# EasyEDA Pro project ProPrj_AUCompetition.epro, board 扩展板
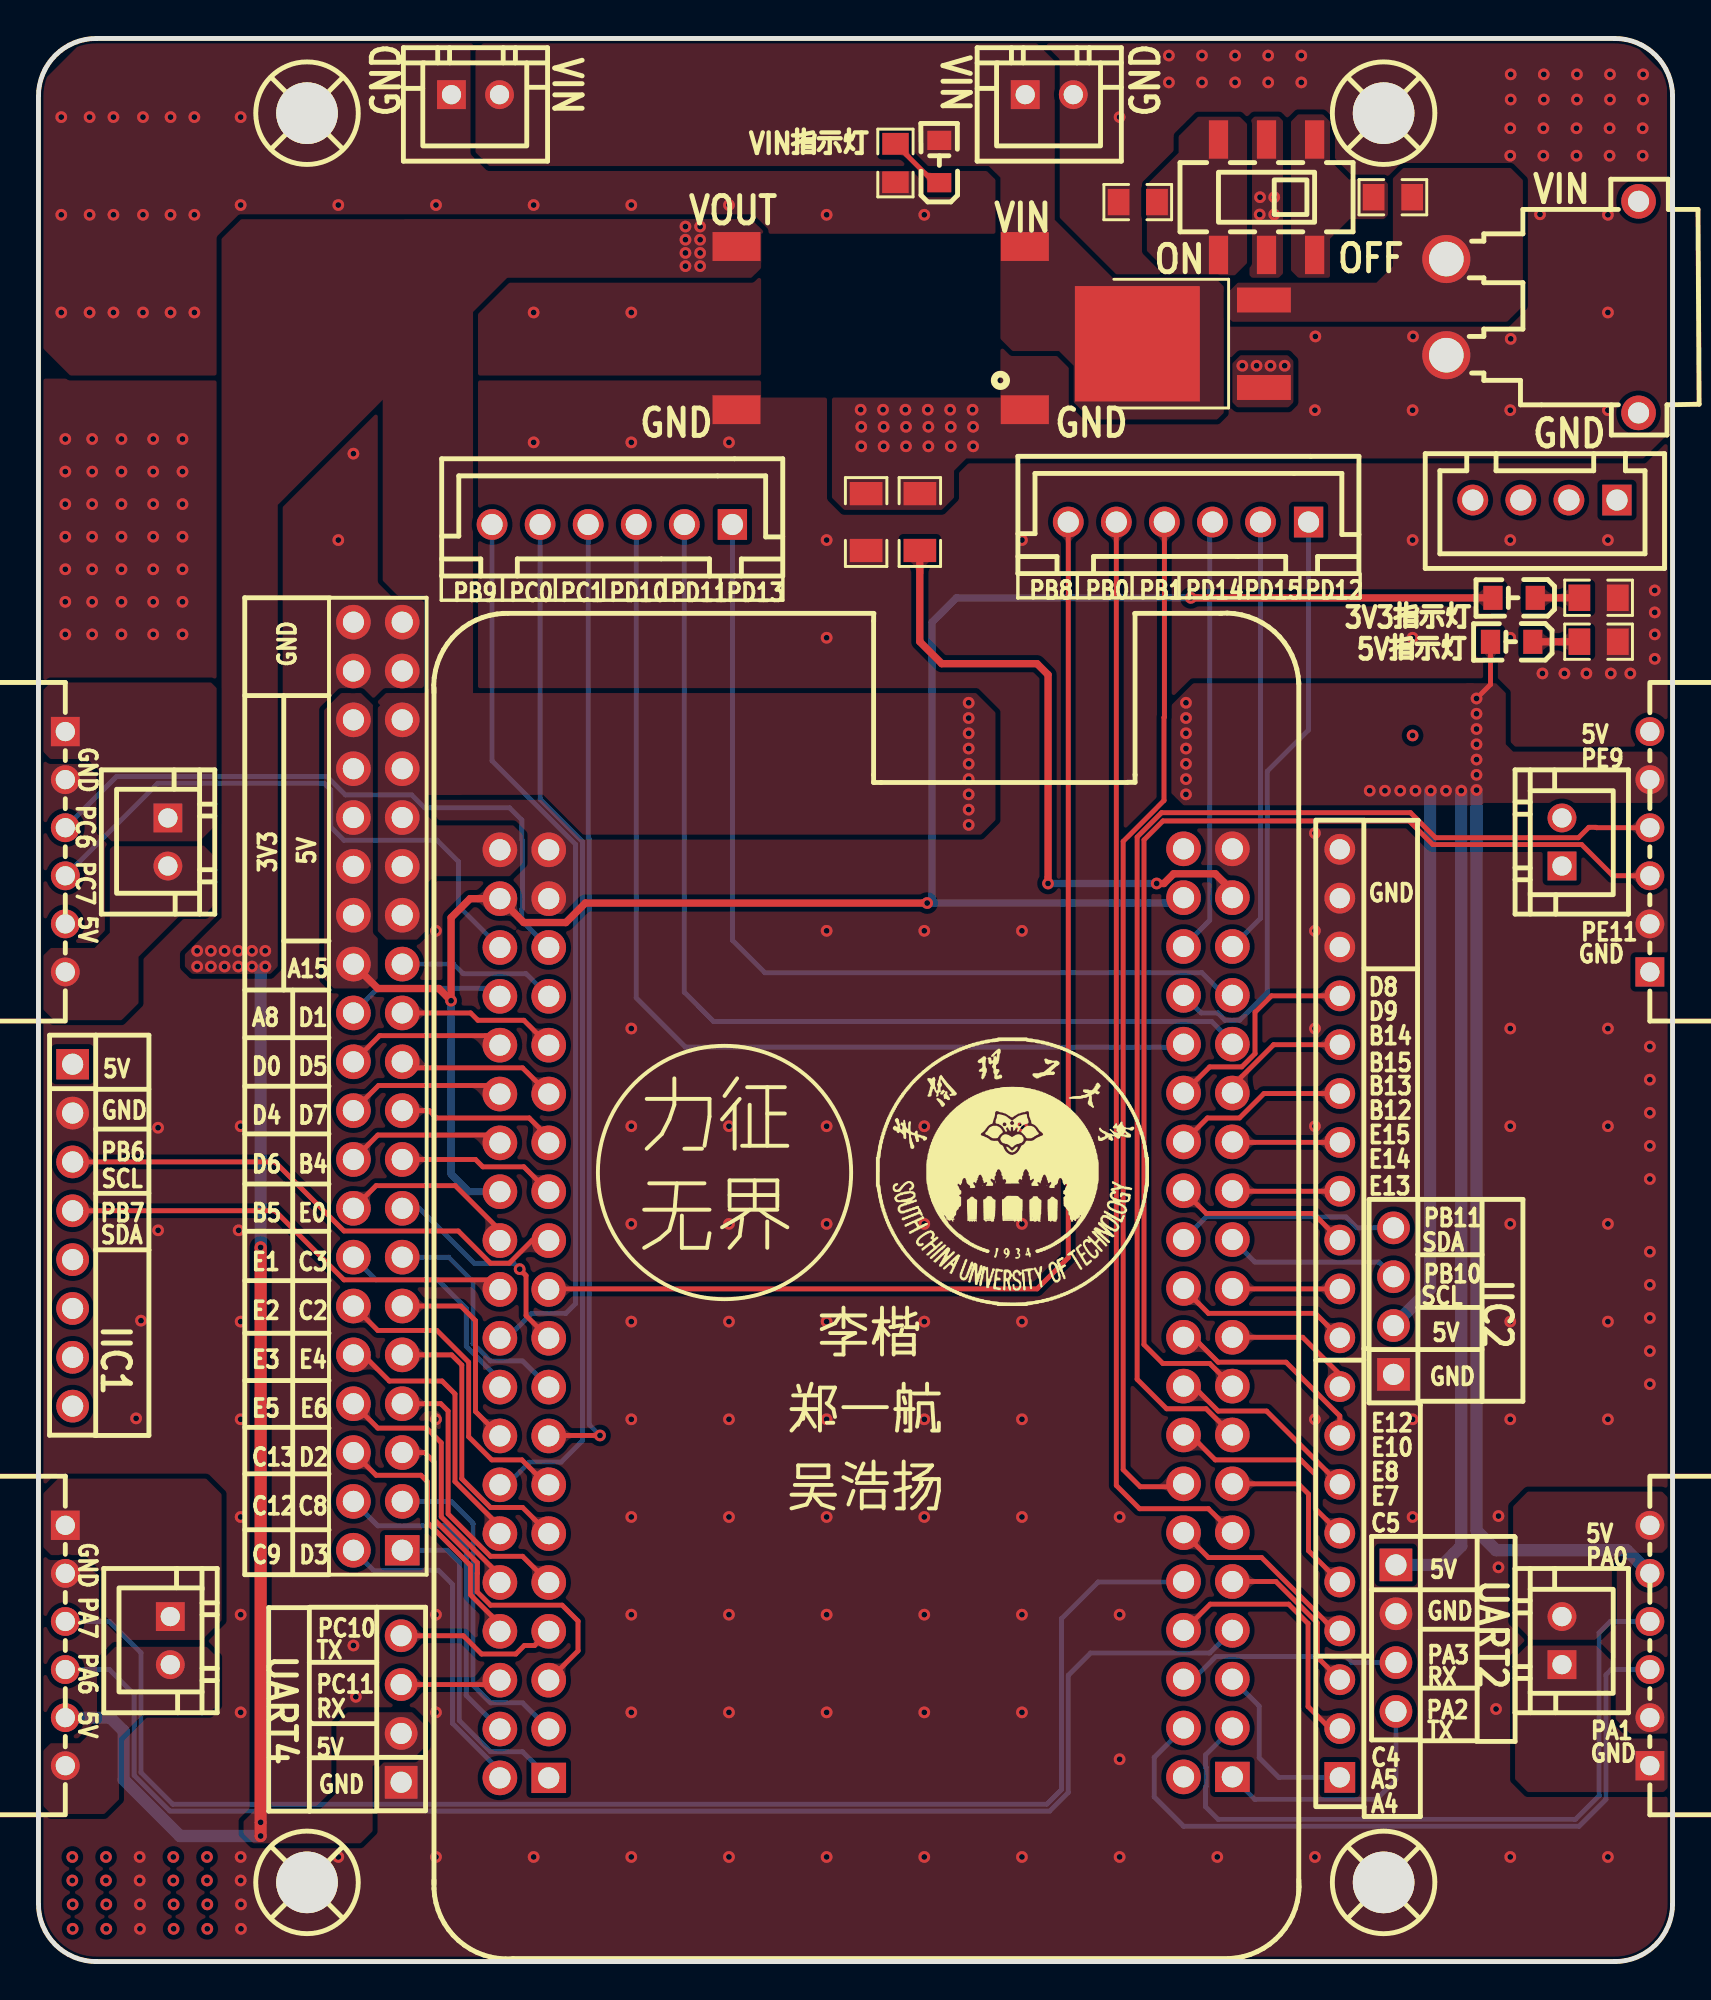
[diagram p5: board, top side]
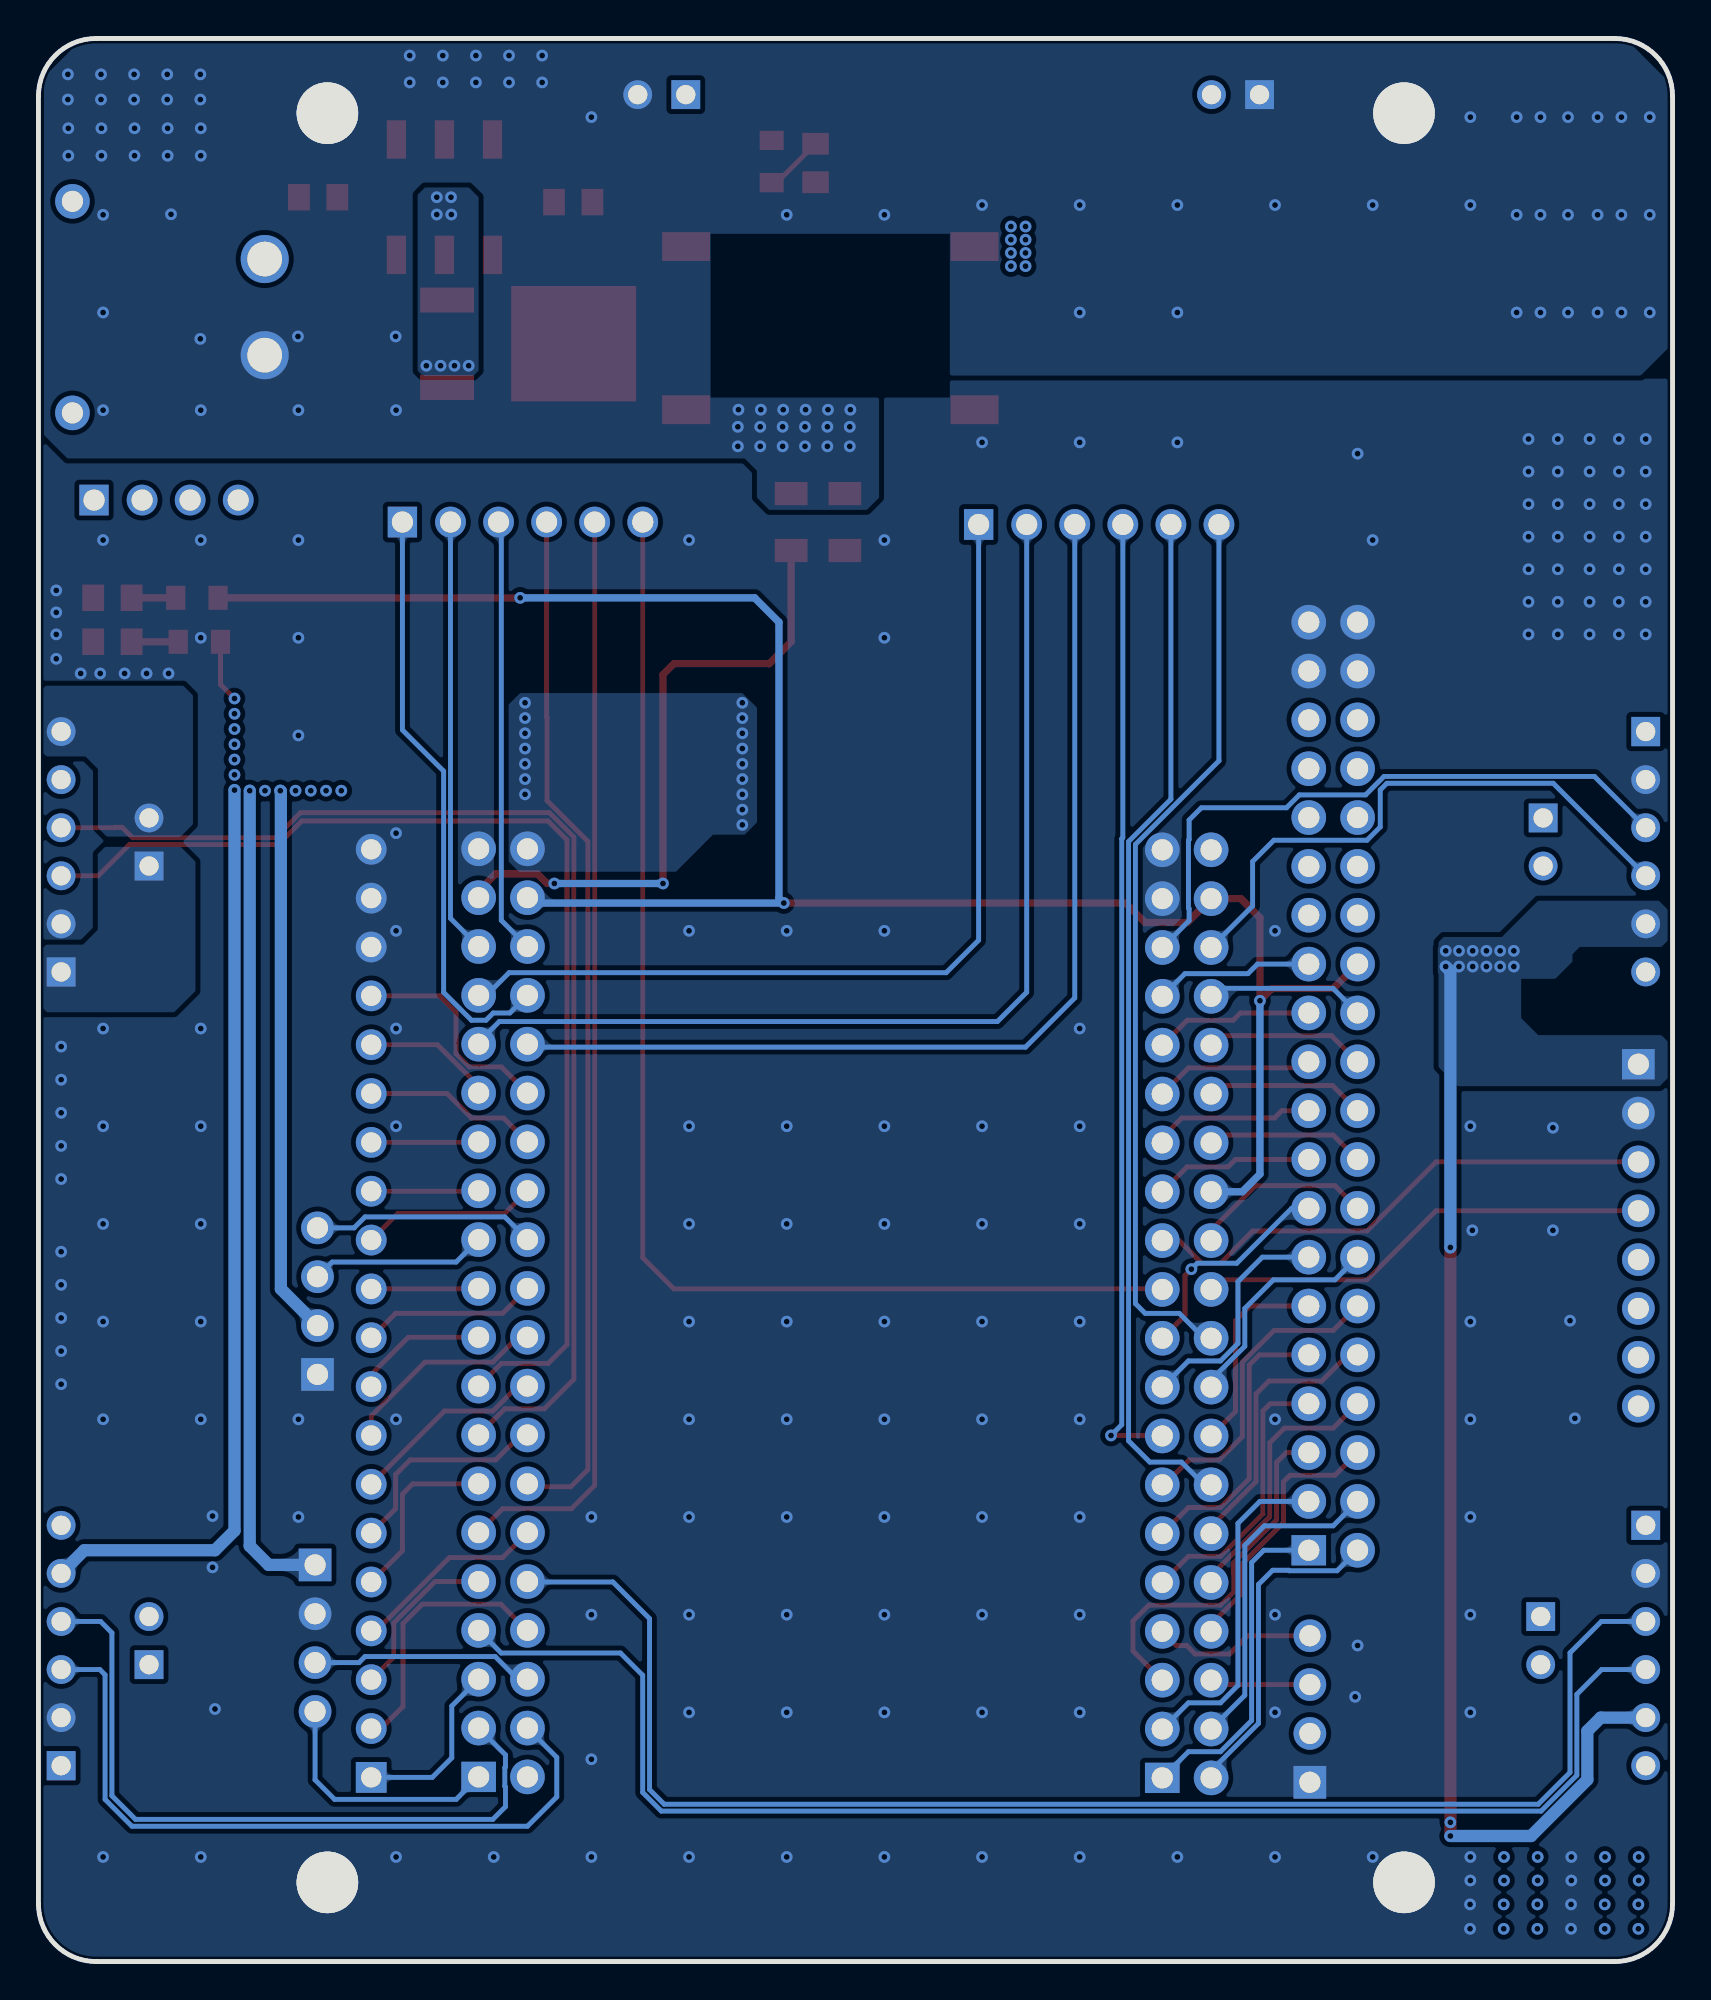
[diagram p6: board, bottom side, seen from below]

Outline 85 x 100 mm; copper layers: Top Layer, Bottom Layer. Coordinates in mm from the lower left corner of the outline.
Outline path: 0,97 0,3 arc(0.88,0.88) 3,0 82,0 arc(84.12,0.88) 85,3 85,97 arc(84.12,99.12) 82,100 3,100 arc(0.88,99.12) 0,97
Stack: Top Layer 0.035mm / Dielectric1 1.51mm FR4 er 4.5 / Bottom Layer 0.035mm

## Design rules (mm)
spacing copperThickness1oz (default): track to track 0.102, other pairs 0.152 to 0.3
spacing copperThickness2oz: track to track 0.203, other pairs 0.152 to 0.3
track width copperThickness1oz (default): min 0.127, default 0.254, max 2.54
track width copperThickness2oz: min 0.203, default 0.254, max 2.54
differential pair differentialPair (default): width min 0.127, default 0.254, max 2.54; gap min 0.152, default 0.152
net RR_OUT2 uses copperRegion
net VIN uses copperRegion
net +5V uses copperRegion
net +3V3 uses copperRegion
net DGND uses copperRegion
net FL_OUT2 uses copperRegion
net FL_OUT1 uses copperRegion
net FR_OUT2 uses copperRegion
net FR_OUT1 uses copperRegion
net RL_OUT2 uses copperRegion
net RL_OUT1 uses copperRegion
net RR_OUT1 uses copperRegion
net $1N204 uses copperRegion
net $1N208 uses copperRegion
net $1N209 uses copperRegion
net $1N206 uses copperRegion

## Placement (name value [footprint] x y rotation side)
CN1  XT30PW-M30.G.Y  [CONN-TH_XT30PW-M]  78.23 86.03 90 top
CN2  HX-XH2.54-2PZZ  [CONN-TH_2P-P2.50_HX-2.54MM-2P-ZZ-MS]  22.73 97.08 0 top
CN3  HX-XH2.54-2PZZ  [CONN-TH_2P-P2.50_HX-2.54MM-2P-ZZ-MS]  52.58 97.08 0 top
CN4  HX-XH2.54-2PZZ  [CONN-TH_2P-P2.50_HX-2.54MM-2P-ZZ-MS]  79.25 16.69 90 top
CN5  HX-XH2.54-2PZZ  [CONN-TH_2P-P2.50_HX-2.54MM-2P-ZZ-MS]  6.86 16.69 270 top
CN6  HX-XH2.54-2PZZ  [CONN-TH_2P-P2.50_HX-2.54MM-2P-ZZ-MS]  79.25 58.22 90 top
CN7  HX-XH2.54-2PZZ  [CONN-TH_2P-P2.50_HX-2.54MM-2P-ZZ-MS]  6.73 58.22 270 top
CN8  ZX-XH2.54-4PZZ  [CONN-TH_4P-P2.50_4PIN]  78.36 76 180 top
H1  2.54-1*4P母  [HDR-TH_4P-P2.54-V-F]  70.48 34.34 90 top
H3  2.54-1*4P母  [HDR-TH_4P-P2.54-V-F]  70.61 16.81 270 top
H4  2.54-1*4P母  [HDR-TH_4P-P2.54-V-F]  18.87 13.13 90 top
LED1  -  [LED_0805]  46.86 93.65 90 top
LED2  -  [LED_0805]  76.58 68.63 180 top
LED3  -  [LED_0805]  76.71 70.92 180 top
Q1  AOD409  [TO-252-2_L6.6-W6.1-P4.57-LS9.9-TL-CW]  60.45 84.13 180 top
R1  10K  [R0805]  70.45 91.75 180 top
R2  10K  [R0805]  57.18 91.49 0 top
R3  0Ω  [R1206]  45.85 74.85 270 top
R4  0Ω  [R1206]  43.05 74.85 270 top
R5  10K  [R0805]  44.58 93.52 270 top
R6  10K  [R0805]  81.15 68.63 0 top
R7  10K  [R0805]  81.15 70.92 0 top
SCREW1  -  [M3螺丝]  13.97 4.12 0 top
SCREW2  -  [M3螺丝]  13.97 96.12 0 top
SCREW3  -  [M3螺丝]  69.97 96.12 0 top
SCREW4  -  [M3螺丝]  69.97 4.12 0 top
U1  LCKFB-LSPI-SkyStar-STM32F407VET6-LITE  [COMM-TH_LCKFB-LSPI-SKYSTAR-STM32F407VET6-LITE]  43.05 33.71 180 top
U2  -  [DCE001]  51.31 80.7 180 top
U3  YSSP2AG00  [SW-SMD_YSSP2AG00]  63.88 91.75 180 top
U4  ZX-XH2.54-6PWZ  [CONN-TH_6P-P2.50_ZX-XH2.54-6PWZ]  83.82 16.43 90 top
U5  ZX-XH2.54-6PWZ  [CONN-TH_6P-P2.50_ZX-XH2.54-6PWZ]  1.4 16.43 270 top
U6  ZX-XH2.54-6PWZ  [CONN-TH_6P-P2.50_ZX-XH2.54-6PWZ]  83.82 57.71 90 top
U7  ZX-XH2.54-6PWZ  [CONN-TH_6P-P2.50_ZX-XH2.54-6PWZ]  1.4 57.71 270 top
U8  ZX-XH2.54-6PZZ  [CONN-TH_6P-P2.50_ZX-XH2.54-6PZZ]  59.82 74.85 0 top
U9  ZX-XH2.54-6PZZ  [CONN-TH_6P-P2.50_ZX-XH2.54-6PZZ]  29.84 74.73 0 top
U10  PZ2.54-2*20  [HDR-TH_40P-P2.54-V-M-R2-C20-S2.54]  17.65 45.52 90 top
U11  PH2.54-01-20PZD  [HDR-TH_20P-P2.54-V-M-4]  67.69 33.71 90 top
U12  PM254-1-08-Z-8.5  [HDR-TH_8P-P2.54-V-F]  1.78 37.77 270 top

## Footprints (pads in the part's own frame, mm; a bottom-side part is the same pattern mirrored in y, then rotated)
COMM-TH_LCKFB-LSPI-SKYSTAR-STM32F407VET6-LITE
  rect 1.8x1.575 hole 1.1: 1(-19.05,24.105) 41(16.51,24.155)
  round 1.8 hole 1.1: 2(-16.51,24.105) 3(-19.05,21.564) 4(-16.51,21.564) 5(-19.05,19.024) 6(-16.51,19.024) 7(-19.05,16.485) 8(-16.51,16.485) 9(-19.05,13.944) 10(-16.51,13.944) 11(-19.05,11.405) 12(-16.51,11.405) 13(-19.05,8.864) 14(-16.51,8.864) 15(-19.05,6.324) 16(-16.51,6.324) 17(-19.05,3.784) 18(-16.51,3.784) 19(-19.05,1.244) 20(-16.51,1.244) 21(-19.05,-1.296) 22(-16.51,-1.296) 23(-19.05,-3.836) 24(-16.51,-3.836) 25(-19.05,-6.375) 26(-16.51,-6.375) 27(-19.05,-8.915) 28(-16.51,-8.915) 29(-19.05,-11.456) 30(-16.51,-11.456) 31(-19.05,-13.995) 32(-16.51,-13.995) 33(-19.05,-16.535) 34(-16.51,-16.535) 35(-19.05,-19.076) 36(-16.51,-19.076) 37(-19.05,-21.616) 38(-16.51,-21.616) 39(-19.05,-24.155) 40(-16.51,-24.155) 42(19.05,24.155) 43(16.51,21.616) 44(19.05,21.616) 45(16.51,19.076) 46(19.05,19.076) 47(16.51,16.535) 48(19.05,16.535) 49(16.51,13.995) 50(19.05,13.995) 51(16.51,11.456) 52(19.05,11.456) 53(16.51,8.915) 54(19.05,8.915) 55(16.51,6.375) 56(19.05,6.375) 57(16.51,3.836) 58(19.05,3.836) 59(16.51,1.296) 60(19.05,1.296) 61(16.51,-1.244) 62(19.05,-1.244) 63(16.51,-3.784) 64(19.05,-3.784) 65(16.51,-6.324) 66(19.05,-6.324) 67(16.51,-8.864) 68(19.05,-8.864) 69(16.51,-11.405) 70(19.05,-11.405) 71(16.51,-13.944) 72(19.05,-13.944) 73(16.51,-16.485) 74(19.05,-16.485) 75(16.51,-19.024) 76(19.05,-19.024) 77(16.51,-21.564) 78(19.05,-21.564) 79(16.51,-24.105) 80(19.05,-24.105)
CONN-TH_2P-P2.50_HX-2.54MM-2P-ZZ-MS
  rect 1.5x1.5 hole 1: 1(-1.25,0)
  round 1.5 hole 1: 2(1.25,0)
CONN-TH_4P-P2.50_4PIN
  rect 1.524x1.6 hole 1.1: 1(-3.75,0)
  round 1.6 hole 1.1: 2(-1.25,0) 3(1.25,0) 4(3.75,0)
CONN-TH_6P-P2.50_ZX-XH2.54-6PWZ
  rect 1.524x1.5 hole 1: 1(-6.25,0)
  round 1.5 hole 1: 2(-3.75,0) 3(-1.25,0) 4(1.25,0) 5(3.75,0) 6(6.25,0)
CONN-TH_6P-P2.50_ZX-XH2.54-6PZZ
  rect 1.524x1.6 hole 1.1: 1(6.25,0)
  round 1.6 hole 1.1: 2(3.75,0) 3(1.25,0) 4(-1.25,0) 5(-3.75,0) 6(-6.25,0)
CONN-TH_XT30PW-M
  round 2.5 hole 1.8: 1(-2.5,5) 2(2.5,5)
  round 1.8 hole 1.1: 3(5.5,-5) 4(-5.5,-5)
DCE001
  rect 2.5x1.5 smd: 1(0,0) 2(0,-8.485) 3(15,0) 4(15,-8.485)
HDR-TH_4P-P2.54-V-F
  rect 1.7x1.7 hole 1.1: 1(-3.81,0)
  round 1.7 hole 1.1: 2(-1.27,0) 3(1.27,0) 4(3.81,0)
HDR-TH_8P-P2.54-V-F
  rect 1.575x1.7 hole 1.1: 1(-8.89,0)
  round 1.7 hole 1.1: 2(-6.35,0) 3(-3.81,0) 4(-1.27,0) 5(1.27,0) 6(3.81,0) 7(6.35,0) 8(8.89,0)
HDR-TH_20P-P2.54-V-M-4
  rect 1.6x1.6 hole 1.05: 1(-24.13,0)
  round 1.6 hole 1.05: 2(-21.59,0) 3(-19.05,0) 4(-16.51,0) 5(-13.97,0) 6(-11.43,0) 7(-8.89,0) 8(-6.35,0) 9(-3.81,0) 10(-1.27,0) 11(1.27,0) 12(3.81,0) 13(6.35,0) 14(8.89,0) 15(11.43,0) 16(13.97,0) 17(16.51,0) 18(19.05,0) 19(21.59,0) 20(24.13,0)
HDR-TH_40P-P2.54-V-M-R2-C20-S2.54
  rect 1.575x1.8 hole 1.1: 1(-24.13,-1.27)
  round 1.8 hole 1.1: 2(-24.13,1.27) 3(-21.59,-1.27) 4(-21.59,1.27) 5(-19.05,-1.27) 6(-19.05,1.27) 7(-16.51,-1.27) 8(-16.51,1.27) 9(-13.97,-1.27) 10(-13.97,1.27) 11(-11.43,-1.27) 12(-11.43,1.27) 13(-8.89,-1.27) 14(-8.89,1.27) 15(-6.35,-1.27) 16(-6.35,1.27) 17(-3.81,-1.27) 18(-3.81,1.27) 19(-1.27,-1.27) 20(-1.27,1.27) 21(1.27,-1.27) 22(1.27,1.27) 23(3.81,-1.27) 24(3.81,1.27) 25(6.35,-1.27) 26(6.35,1.27) 27(8.89,-1.27) 28(8.89,1.27) 29(11.43,-1.27) 30(11.43,1.27) 31(13.97,-1.27) 32(13.97,1.27) 33(16.51,-1.27) 34(16.51,1.27) 35(19.05,-1.27) 36(19.05,1.27) 37(21.59,-1.27) 38(21.59,1.27) 39(24.13,-1.27) 40(24.13,1.27)
LED_0805
  rect 1x1.25 smd: 1(-1.15,0.005) 2(1.05,0.005)
M3螺丝
  round 3.2 hole 3.2: 1(0,0)
R0805
  rect 1.133x1.377 smd: 1(-1,0) 2(1,0)
R1206
  rect 1.208x1.701 smd: 1(-1.479,0) 2(1.479,0)
SW-SMD_YSSP2AG00
  rect 1x2 smd: 1(-2.5,3) 2(0,3) 3(2.5,3) 4(-2.5,-3) 5(0,-3) 6(2.5,-3)
TO-252-2_L6.6-W6.1-P4.57-LS9.9-TL-CW
  rect 2.8x1.3 smd: 1(-3.292,2.273) 3(-3.292,-2.273)
  rect 6.5x6 smd: 2(3.292,0)

## Nets
As in the schematic.

Pads without a net: CN1 3 4; CN8 1 2 3 4; U1 2; U12 5 6 7 8

## Via types
v1: diameter 0.61, hole 0.305, Top Layer to Bottom Layer, 340 vias

## Routing (per net, layer and track width the routed paths; a pad name or vN(x,y) marks a point on that pad's centre or on a via; arc(x,y) is an arc through that point)
+3V3: length 106.1
  Top Layer w0.381: v1(59.94,70.91) 75.66,70.91 ; v1(46.23,55.04) 28.45,55.04 27.43,54.03 25.25,54.03 U1.78 22.45,55.27 21.46,54.28 v1(21.46,49.96) 20.83,50.6 17.65,50.6 16.38,51.87
  Bottom Layer w0.381: U1.38 59.28,55.04 v1(46.23,55.04) 46.48,55.3 46.48,69.65 47.75,70.91 v1(59.94,70.91) ; U1.66 22.38,40.03 21.46,40.95 v1(21.46,49.96)
+5V: length 182.9
  Top Layer w0.254: v1(74.8,65.68) 75.53,66.41 LED2.2
  Top Layer w0.635: v1(11.56,6.53) v1(11.56,37.14)
  Bottom Layer w0.635: U4.5 82.62,21.39 75.82,21.39 74.8,22.4 v1(74.8,60.92) ; v1(11.56,6.53) 7.36,6.53 4.43,9.46 4.43,11.99 3.74,12.68 U5.5 ; v1(72.42,60.88) 72.39,60.85 72.39,34.98 H1.2 ; v1(11.8,51.74) 11.56,51.5 v1(11.56,37.14) ; v1(74.01,60.88) 74.01,21.61 73.03,20.62 H3.1
  vias: v1(8.25,52.56) v1(8.25,51.74) v1(8.97,52.56) v1(8.97,51.74) v1(9.68,52.56) v1(9.68,51.74) v1(10.4,52.56) v1(10.4,51.74) v1(11.11,52.56) v1(11.11,51.74) v1(11.56,7.24) v1(11.8,52.56) v1(33.66,90.22) v1(33.66,89.53) v1(33.66,88.85) v1(33.66,88.16) v1(34.42,90.22) v1(34.42,89.53) v1(34.42,88.85) v1(34.42,88.16) v1(48.39,65.46) v1(48.39,64.66) v1(48.39,63.87) v1(48.39,63.08) v1(48.39,62.28) v1(48.39,61.49) v1(48.39,60.69) v1(48.39,59.9) v1(48.39,59.11) v1(59.69,65.46) v1(59.69,64.66) v1(59.69,63.87) v1(59.69,63.08) v1(59.69,62.28) v1(59.69,61.49) v1(59.69,60.69) v1(69.25,60.88) v1(70.04,60.88) v1(70.83,60.88) v1(71.63,60.88) v1(73.22,60.88) v1(74.8,64.88) v1(74.8,64.09) v1(74.8,63.3) v1(74.8,62.5) v1(74.8,61.71)
AGND: length 33.5
  Top Layer w0.381: R3.2 45.85,68.63 46.99,67.49 51.94,67.49 52.51,66.92 v1(52.51,56.06) ; U1.37 62.1,55.68 61.22,56.56 59.05,56.56 58.54,56.06 v1(58.17,56.06)
  Bottom Layer w0.381: v1(52.51,56.06) v1(58.17,56.06)
DGND:
  vias: v1(1.4,79.17) v1(1.4,77.48) v1(1.4,75.79) v1(1.4,74.09) v1(1.4,72.4) v1(1.4,70.71) v1(1.4,69.01) v1(2.79,79.17) v1(2.79,77.48) v1(2.79,75.79) v1(2.79,74.09) v1(2.79,72.4) v1(2.79,70.71) v1(2.79,69.01) v1(4.32,79.17) v1(4.32,77.48) v1(4.32,75.79) v1(4.32,74.09) v1(4.32,72.4) v1(4.32,70.71) v1(4.32,69.01) v1(5.08,28.25) v1(5.26,5.44) v1(5.26,4.22) v1(5.28,2.97) v1(5.28,1.7) v1(5.33,33.33) v1(5.97,79.17) v1(5.97,77.48) v1(5.97,75.79) v1(5.97,74.09) v1(5.97,72.4) v1(5.97,70.71) v1(5.97,69.01) v1(6.22,43.36) v1(6.22,38.02) v1(7.49,79.17) v1(7.49,77.48) v1(7.49,75.79) v1(7.49,74.09) v1(7.49,72.4) v1(7.49,70.71) v1(7.49,69.01) v1(10.41,38.02) v1(10.52,43.44) v1(10.52,33.28) v1(10.52,28.2) v1(10.52,23.12) v1(10.52,18.04) v1(10.52,12.96) v1(10.52,5.44) v1(10.52,4.22) v1(10.53,2.97) v1(10.53,1.7) v1(15.6,73.92) v1(15.6,5.44) v1(16.38,78.41) v1(16.38,16.43) v1(16.51,13.77) v1(20.68,53.6) v1(20.68,28.2) v1(20.68,18.04) v1(20.68,12.96) v1(20.68,5.44) v1(25.76,79) v1(25.76,5.44) v1(30.84,79) v1(30.84,48.52) v1(30.84,43.44) v1(30.84,38.36) v1(30.84,33.28) v1(30.84,28.2) v1(30.84,23.12) v1(30.84,18.04) v1(30.84,12.96) v1(30.84,5.44) v1(35.92,79) v1(35.92,43.44) v1(35.92,38.36) v1(35.92,33.28) v1(35.92,28.2) v1(35.92,23.12) v1(35.92,18.04) v1(35.92,12.96) v1(35.92,5.44) v1(41,73.92) v1(41,68.84) v1(41,53.6) v1(41,43.44) v1(41,38.36) v1(41,33.28) v1(41,28.2) v1(41,23.12) v1(41,18.04) v1(41,12.96) v1(41,5.44) v1(46.08,53.6) v1(46.08,43.44) v1(46.08,38.36) v1(46.08,33.28) v1(46.08,28.2) v1(46.08,23.12) v1(46.08,18.04) v1(46.08,12.96) v1(46.08,5.44) v1(51.16,73.92) v1(51.16,53.6) v1(51.16,43.44) v1(51.16,38.36) v1(51.16,33.28) v1(51.16,28.2) v1(51.16,23.12) v1(51.16,18.04) v1(51.16,12.96) v1(51.16,5.44) v1(56.24,23.12) v1(56.24,18.04) v1(56.24,10.52) v1(56.24,5.44) v1(61.32,5.44) v1(66.4,58.68) v1(66.4,53.6) v1(66.4,48.52) v1(66.4,43.44) v1(66.4,28.2) v1(66.4,5.44) v1(71.48,73.92) v1(71.48,68.84) v1(71.48,63.76) v1(71.48,28.2) v1(71.48,23.12) v1(75.82,13.13) v1(75.95,23.17) v1(75.95,20.5) v1(76.56,73.92) v1(76.56,68.84) v1(76.56,48.52) v1(76.56,43.44) v1(76.56,38.36) v1(76.56,33.28) v1(76.56,28.2) v1(76.56,5.44) v1(78.23,66.98) v1(79.38,66.98) v1(80.52,66.98) v1(81.64,73.92) v1(81.64,48.52) v1(81.64,43.44) v1(81.64,38.36) v1(81.64,33.28) v1(81.64,28.2) v1(81.64,5.44) v1(81.79,66.98) v1(82.8,66.98) v1(83.82,47.58) v1(83.82,45.86) v1(83.82,44.14) v1(83.82,42.41) v1(83.82,40.69) v1(83.82,36.91) v1(83.82,35.19) v1(83.82,33.47) v1(83.82,31.75) v1(83.82,30.02) v1(84.07,71.3) v1(84.07,70.16) v1(84.07,69.01) v1(84.07,67.74)
PGND:
  vias: v1(1.19,95.91) v1(1.19,90.83) v1(1.19,85.75) v1(2.66,95.91) v1(2.66,90.83) v1(2.66,85.75) v1(3.9,95.91) v1(3.9,90.83) v1(3.9,85.75) v1(5.44,95.91) v1(5.44,90.83) v1(5.44,85.75) v1(6.87,95.91) v1(6.87,90.83) v1(6.87,85.75) v1(8.11,95.91) v1(8.11,90.83) v1(8.11,85.75) v1(10.52,95.91) v1(10.52,91.34) v1(15.6,91.34) v1(20.68,91.34) v1(25.76,91.34) v1(25.76,85.75) v1(30.84,91.34) v1(30.84,85.75) v1(35.92,91.34) v1(41,90.83) v1(42.77,80.7) v1(42.8,79.81) v1(42.8,78.79) v1(43.93,80.7) v1(43.96,79.81) v1(43.96,78.79) v1(45.1,80.7) v1(45.13,79.81) v1(45.13,78.79) v1(46.08,90.83) v1(46.26,80.7) v1(46.29,79.81) v1(46.29,78.79) v1(47.42,80.7) v1(47.46,79.81) v1(47.46,78.79) v1(48.59,80.7) v1(48.62,79.81) v1(48.62,78.79) v1(56.24,95.91) v1(58.8,99.11) v1(58.8,97.71) v1(60.52,99.11) v1(60.52,97.71) v1(62.25,99.11) v1(62.25,97.71) v1(63.97,99.11) v1(63.97,97.71) v1(65.69,99.11) v1(65.69,97.71) v1(66.4,80.67) v1(66.42,84.51) v1(71.5,84.51) v1(71.48,80.67) v1(76.58,98.13) v1(76.58,96.83) v1(76.56,95.33) v1(76.56,93.9) v1(76.58,84.38) v1(76.56,80.67) v1(78.1,90.86) v1(78.3,98.13) v1(78.3,96.83) v1(78.28,95.33) v1(78.28,93.9) v1(80,95.33) v1(80,93.9) v1(80.03,98.13) v1(80.03,96.83) v1(81.64,90.83) v1(81.64,85.75) v1(81.64,80.67) v1(81.75,98.13) v1(81.75,96.83) v1(81.72,95.33) v1(81.72,93.9) v1(83.47,98.13) v1(83.47,96.83) v1(83.45,95.33) v1(83.45,93.9)
(no net):
  vias: v1(1.76,5.44) v1(1.76,4.22) v1(1.78,2.97) v1(1.78,1.7) v1(3.51,5.44) v1(3.51,4.22) v1(3.53,2.97) v1(3.53,1.7) v1(7.02,5.44) v1(7.02,4.22) v1(7.03,2.97) v1(7.03,1.7) v1(8.77,5.44) v1(8.77,4.22) v1(8.78,2.97) v1(8.78,1.7)
FL_EN: length 66
  Top Layer w0.254: U1.61 26.57,34.98 51.94,34.98 53.57,36.6 U8.6
FL_ENCA: length 37.3
  Bottom Layer w0.254: U4.4 81.77,17.68 81.18,17.09 81.18,8.62 79.95,7.39 61.37,7.39 60.71,8.05 60.71,9.08 60.74,9.11 60.74,10.09 60.71,10.13 60.71,10.74 U1.3
FL_ENCB: length 37.8
  Bottom Layer w0.254: U4.3 81.81,15.18 81.53,14.91 81.53,8.43 80.14,7.04 59.56,7.04 58.04,8.56 58.04,10.62 U1.4
FL_IN1: length 57.2
  Top Layer w0.254: U8.5 56.07,24.76 57.28,23.55 60.86,23.55 U1.11
FL_IN2: length 53.7
  Top Layer w0.254: U8.4 58.57,64.71 58.55,64.69 58.55,60.37 56.42,58.25 56.42,25.58 57.31,24.69 59.41,24.69 U1.14
FR_1N2: length 50.3
  Top Layer w0.254: v1(29.21,27.36) 26.57,27.36 U1.55
  Bottom Layer w0.254: v1(29.21,27.36) 28.65,27.91 28.65,58.39 28.59,58.44 U9.4
FR_EN: length 47
  Bottom Layer w0.254: U1.60 24.36,32.41 25.66,33.71 27.43,33.71 27.94,34.21 27.94,58.09 23.59,62.44 U9.6
FR_ENCA: length 73.7
  Bottom Layer w0.254: U5.4 3.69,15.18 4.98,13.89 4.98,9.68 6.84,7.82 52.6,7.82 53.57,8.79 53.57,14.89 54.73,16.04 60.92,16.04 U1.7
FR_ENCB: length 75.8
  Bottom Layer w0.254: U1.10 59.54,19.74 55.12,19.74 53.21,17.83 53.21,8.94 52.45,8.18 6.98,8.18 5.33,9.83 5.33,16.05 3.7,17.68 U5.3
FR_IN1: length 53.8
  Bottom Layer w0.254: U1.54 24.36,24.79 25.54,25.97 27.19,25.97 28.3,27.08 28.3,58.24 26.09,60.44 U9.5
IIC1_SCL: length 27.4
  Top Layer w0.254: U12.3 12.3,41.58 15.89,37.99 21.84,37.99 23.51,36.31 24.49,36.31 25.67,37.49 U1.63
IIC1_SDA: length 23.9
  Top Layer w0.254: U12.4 12.3,39.04 15.89,35.45 23.51,35.45 U1.62
IIC2_SCL: length 9.2
  Bottom Layer w0.254: U1.23 63.27,36.37 69.72,36.37 H1.3
IIC2_SDA: length 11.6
  Bottom Layer w0.254: H1.4 68.58,38.15 68.01,38.72 60.74,38.72 U1.24
PA2: length 13
  Bottom Layer w0.254: H3.4 70.61,9.45 69.6,8.43 63.27,8.43 U1.1
PA3: length 11.7
  Bottom Layer w0.254: H3.3 68.33,15.55 68.01,15.86 61.25,15.86 60.07,14.68 U1.6
PA4: length 9.3
  Bottom Layer w0.254: U1.5 63.5,13.28 63.5,10.59 64.52,9.58 U11.1
PA5: length 13.9
  Top Layer w0.254: U1.8 59.59,17.22 60.95,18.58 65.03,18.58 66.04,17.58 66.04,13.26 67.18,12.12 U11.2
PA8: length 8.3
  Bottom Layer w0.254: 16.38,49.33 17.66,50.61 23.59,50.61 U1.74
PA15: length 8.3
  Bottom Layer w0.254: U1.73 25.36,51.37 22.09,51.37 21.59,51.87 U10.25
PB4: length 8.3
  Top Layer w0.254: U10.17 22.73,41.71 23.11,41.33 25.25,41.33 U1.65
PB5: length 9.6
  Top Layer w0.254: 16.38,39.17 17.56,40.35 21.68,40.35 24,38.02 U1.64
PB12: length 9.2
  Top Layer w0.254: U1.26 60.74,38.9 66.3,38.9 U11.12
PB13: length 5.6
  Top Layer w0.254: U11.13 62.13,40.06 U1.25
PB14: length 9.2
  Top Layer w0.254: U11.15 63.75,45.14 62.47,43.87 60.81,43.87 U1.28
PB15: length 5.6
  Top Layer w0.254: U11.14 62.13,42.6 U1.27
PC2: length 10.6
  Top Layer w0.254: U1.56 22.73,28.6 22.73,33.33 21.97,34.09 U10.11
PC3: length 12.3
  Bottom Layer w0.254: U10.13 21.34,36.63 22.61,35.36 22.61,32.14 23.51,31.23 25.18,31.23 U1.57
PC4: length 8.7
  Top Layer w0.254: U1.9 64.37,19.76 66.52,17.61 66.52,15.83 U11.3
PC5: length 10.2
  Top Layer w0.254: U11.4 67.44,17.2 63.63,21.01 60.86,21.01 U1.12
PC6: length 33
  Bottom Layer w0.254: U7.3 4.06,61.63 15.01,61.63 15.97,60.67 19.41,60.67 20.08,60 24.51,60 25.15,59.36 25.15,58.34 25.18,58.3 25.18,54.78 25.15,54.75 25.15,54.13 U1.75
PC7: length 30.6
  Bottom Layer w0.254: U1.76 21.84,54.89 21.84,57.2 20.74,58.31 15.89,58.31 15.2,59 15.2,60.92 14.86,61.27 6.21,61.27 U7.4
PC8: length 17.5
  Bottom Layer w0.254: U1.43 25.18,13.45 23.51,13.45 22.61,14.36 22.61,22.78 21.46,23.93 U10.3
PC9: length 17
  Bottom Layer w0.254: 16.38,21.39 17.45,20.32 19.94,20.32 19.96,20.35 20.8,20.35 21.54,19.61 21.54,12.39 24,9.92 U1.42
PC10: length 8.6
  Top Layer w0.254: U1.47 25.81,16.43 25.27,16.43 24.83,15.99 23.05,15.99 22.1,16.94 H4.4
PC11: length 5.2
  Top Layer w0.254: U1.46 23.77,14.4 H4.3
PC12: length 17.1
  Bottom Layer w0.254: 16.38,23.93 17.65,22.66 21.23,22.66 22.25,21.64 22.25,13.84 U1.44
PC13: length 13.8
  Top Layer w0.254: 16.38,26.47 17.56,25.29 19.9,25.29 20.24,24.94 20.24,22.82 22.47,20.6 22.47,19.08 24,17.54 U1.48
PD0: length 8.4
  Top Layer w0.254: U1.72 23.51,48.15 17.74,48.15 16.38,46.79
PD1: length 8.3
  Top Layer w0.254: U10.23 22.48,49.33 22.86,48.95 25.25,48.95 U1.71
PD2: length 19.1
  Top Layer w0.254: U1.45 28.07,16.15 28.07,17.7 27.24,18.53 23.51,18.53 22.82,19.22 22.82,20.2 22.83,20.21 22.83,20.74 20.6,22.97 20.6,25.96 20.09,26.47 U10.5
PD3: length 17.3
  Bottom Layer w0.254: U1.41 25.18,10.91 23.51,10.91 21.89,12.53 21.89,20.75 21.26,21.39 U10.1
PD4: length 8.3
  Top Layer w0.254: 16.38,44.25 17.69,45.55 23.56,45.55 U1.70
PD5: length 8.3
  Top Layer w0.254: U1.69 25.18,46.47 19.24,46.47 U10.21
PD6: length 8.3
  Top Layer w0.254: 16.38,41.71 17.65,42.98 23.6,42.98 U1.68
PD7: length 8.5
  Top Layer w0.254: U1.67 26.54,42.85 25.53,43.87 20.7,43.87 20.32,44.25 U10.19
PD8: length 11.5
  Top Layer w0.254: U11.17 64.13,50.22 63.28,49.36 63.28,47.21 62.59,46.52 60.92,46.52 U1.30
PD9: length 6.8
  Top Layer w0.254: U11.16 64.25,47.68 62.1,45.53 U1.29
PD10: length 54.2
  Bottom Layer w0.254: U1.32 59.41,47.55 33.66,47.55 31.1,50.11 U9.3
PD11: length 54
  Bottom Layer w0.254: U1.31 62.1,47.8 61.03,48.88 35.12,48.88 33.59,50.4 U9.2
PD12: length 30.8
  Bottom Layer w0.254: U8.1 66.07,64.04 63.92,61.9 63.92,50.39 62.48,48.95 61.72,48.95 61.34,49.33 60.48,49.33 U1.34
PD13: length 48.8
  Bottom Layer w0.254: U9.1 36.1,53.11 37.78,51.42 60.52,51.42 61.7,50.24 U1.33
PD14: length 22.7
  Bottom Layer w0.254: U8.3 60.92,74.71 60.92,54.14 U1.36
PD15: length 22.7
  Bottom Layer w0.254: U1.35 63.57,54.25 U8.2
PE0: length 11.6
  Top Layer w0.254: v1(25.03,36) 25.36,35.67 25.36,33.59 U1.59
  Bottom Layer w0.254: v1(25.03,36) 24.72,36.31 22.67,36.31 19.81,39.17 U10.15
PE1: length 11.8
  Bottom Layer w0.254: U1.58 24,30.24 22.25,31.99 22.25,33.96 20.76,35.45 17.56,35.45 16.38,36.63
PE2: length 16.3
  Top Layer w0.254: U1.53 26.44,24.79 25.15,26.09 23.58,26.09 22.38,27.29 22.38,31.17 20.73,32.82 17.65,32.82 16.38,34.09
PE3: length 14.4
  Top Layer w0.254: U1.52 24,22.62 21.66,24.96 21.66,29.52 20.99,30.19 18.25,30.19 16.89,31.55 16.38,31.55
PE4: length 14.9
  Top Layer w0.254: U10.9 21.49,31.55 22.02,31.02 22.02,25.11 23.51,23.61 25.18,23.61 U1.51
PE5: length 13.9
  Top Layer w0.254: 16.38,29.01 17.65,27.74 20.19,27.74 20.95,26.98 20.95,23.13 24,20.08 U1.50
PE6: length 14.6
  Top Layer w0.254: U10.7 20.93,29.01 21.31,28.63 21.31,23.28 23.51,21.07 25.18,21.07 U1.49
PE7: length 9.4
  Top Layer w0.254: U1.13 65.53,24.84 66.06,24.31 66.06,21.36 U11.5
PE8: length 11.3
  Top Layer w0.254: U11.6 66.42,23.55 66.42,25.32 65.66,26.09 61.21,26.09 59.92,27.38 U1.16
PE9: length 62.3
  Top Layer w0.254: U1.15 60.74,28.74 58.68,28.74 57.15,30.28 57.15,58.47 58.42,59.74 71.37,59.74 72.67,58.44 80.1,58.44 80.65,58.98 81.03,58.98 81.05,58.96 U6.4
PE10: length 10.2
  Top Layer w0.254: U1.18 60.07,29.92 61.36,28.63 63.88,28.63 U11.7
PE11: length 59.6
  Top Layer w0.254: U6.3 81.9,56.46 80.27,58.08 72.53,58.08 71.3,59.31 58.49,59.31 57.51,58.32 57.51,32.08 58.49,31.1 60.92,31.1 U1.17
PE12: length 10.8
  Top Layer w0.254: U1.20 59.84,32.18 60.35,32.18 61.36,31.17 64.9,31.17 67.69,28.37 U11.8
PE13: length 7
  Top Layer w0.254: U11.9 67.69,30.53 65.76,32.46 U1.19
PE14: length 9.2
  Top Layer w0.254: U11.10 66.42,33.71 60.86,33.71 U1.22
PE15: length 5.6
  Top Layer w0.254: U1.21 62.13,34.98 U11.11
$1N208:
  vias: v1(62.62,82.98) v1(63.36,82.98) v1(63.54,91.75) v1(63.52,90.84) v1(64.09,82.98) v1(64.28,91.75) v1(64.28,90.84) v1(64.82,82.98)
$1N243: length 3.1
  Top Layer w0.254: R5.1 46.6,92.5 LED1.1
$1N244: length 2.4
  Top Layer w0.381: LED2.1 80.15,68.63 R6.1
$1N245: length 2.3
  Top Layer w0.381: 77.86,70.91 80.15,70.91 R7.1

## Copper pours and planes (outline as drawn; the poured copper is in the pictures)
+3V3 on Top Layer: 17.65,65.09 17.65,51.13 17.12,50.6 15.37,50.6 14.86,51.11 14.86,65.08 15.75,65.96 16.78,65.96
+5V on Top Layer: 8,51.36 7.62,51.74 7.62,52.38 9.53,54.28 9.53,89.59 10.54,90.6 36.83,90.6 37.59,89.84 37.59,88.32 36.96,87.68 24.38,87.68 12.45,75.74 12.45,51.74 12.06,51.36
+5V on Top Layer: 18.41,65.96 19.63,65.96 20.19,65.4 20.19,59.63 20.74,59.08 24.7,59.08 25.18,58.6 25.18,57.11 24.51,56.44 20.59,56.44 20.19,56.04 20.19,53.65 19.69,53.14 18.09,53.14 17.65,53.58 17.65,65.2
+5V on Top Layer: 37.72,89.97 37.72,88.19 37.08,87.55 24.38,87.55 22.61,85.78 22.61,61.27 22.01,60.67 18.31,60.67 17.65,61.32 17.65,65.31 18.18,65.84 19.94,65.84 20.32,66.22 20.32,70.79 20.07,71.04 18.67,71.04 17.91,71.81 17.91,89.46 19.05,90.6 37.08,90.6
+5V on Top Layer: 60.07,66.47 74.68,66.47 75.44,65.71 75.44,60.5 75.06,60.12 59.56,60.12 58.93,60.76 58.93,65.33
+5V on Top Layer: 85,62.36 85,60.88 84.37,60.25 74.42,60.25 74.04,60.63 74.04,66.22 74.29,66.47 75.82,66.47 76.33,65.96 76.33,63.3 76.71,62.92 84.44,62.92
+5V on Top Layer: 18.08,65.96 48.77,65.96 49.78,64.95 49.78,59.36 49.02,58.6 28.32,58.6 26.25,60.67 18.38,60.67 17.65,61.39 17.65,65.54
+5V on Top Layer: 20.14,12.26 20.14,11.19 19.56,10.62 17.85,10.62 17.38,10.15 17.38,6.78 16.75,6.15 11.18,6.15 10.67,6.66 10.67,7.29 11.2,7.82 14.56,7.82 15.49,8.75 15.49,12.37 16.09,12.97 19.43,12.97
+5V on Bottom Layer: 0,54.46 0.71,55.17 6.98,55.17 9.14,53.01 11.94,53.01 12.21,52.74 12.21,51.41 12,51.11 6.1,51.11 5.21,51.99 5.21,52.38 4.83,52.76 0.58,52.76 0,53.33
+5V on Bottom Layer: 0,47.59 0.58,48.17 6.98,48.17 7.87,49.06 7.87,52.9 8.25,53.28 11.91,53.28 12.17,53.01 12.17,46.51 11.18,45.52 0.67,45.52 0,46.18
+5V on Bottom Layer: 47.62,65.2 48.39,65.96 59.94,65.96 60.58,65.33 60.58,57.24 60.01,56.67 51.84,56.67 49.91,58.6 48.26,58.6 47.62,59.23
DGND on Top Layer: 0,82.31 84.96,82.31 84.96,-0.08 0,-0.08
DGND on Bottom Layer: 0,82.31 84.96,82.31 84.96,-0.08 0,-0.08
PGND on Top Layer: 41.28,76.12 41.28,81.46 40.26,82.47 1.65,82.47 0.06,84.06 0.06,97.62 2.33,99.89 82.82,99.89 84.71,97.99 84.71,79.38 83.49,78.16 48.26,78.16 47.62,77.52 47.62,76.12 46.99,75.49 41.91,75.49
PGND on Bottom Layer: 41.28,76.12 41.28,81.46 40.26,82.47 1.65,82.47 0.06,84.06 0.06,97.62 2.33,99.89 82.82,99.89 84.71,97.99 84.71,79.38 83.49,78.16 48.26,78.16 47.62,77.52 47.62,76.12 46.99,75.49 41.91,75.49
VIN on Top Layer: 55.96,87.48 61.28,87.48 61.65,87.11 61.65,80.53 61.31,80.19 54.74,80.19 53.85,81.08 53.85,82.98 53.09,83.74 50.67,83.74 50.04,84.38 50.04,92.76 49.43,93.37 23.45,93.37 22.73,94.08 22.73,99.37 23.37,100 51.68,100 52.87,98.82 52.87,90.57
FL_OUT1 on Top Layer: 84.46,24.44 85,23.89 85,21.78 84.48,21.26 82.42,21.26 81.84,20.68 81.84,17.6 80.97,16.73 77.66,16.73 76.71,17.69 76.71,23.67 77.47,24.44
FL_OUT2 on Top Layer: 85,11.21 85,9.28 84.53,8.81 77.47,8.81 76.81,9.48 76.81,15.82 77.43,16.43 81.03,16.43 81.79,15.67 81.79,12.5 82.69,11.6 84.61,11.6
FR_OUT1 on Top Layer: 0,10.72 0.64,11.35 2.16,11.35 3.3,12.5 3.3,15.67 3.99,16.36 8.75,16.36 9.3,15.82 9.3,13.33 8.9,12.94 5.52,12.94 4.19,11.61 4.19,8.43 3.43,7.67 0.66,7.67 0,8.33
FR_OUT2 on Top Layer: 0,24.09 1.02,25.11 8.72,25.11 9.53,24.31 9.53,17.74 8.51,16.72 4.73,16.72 3.4,18.06 3.4,20.15 2.41,21.13 0.66,21.13 0,21.79
RL_OUT1 on Bottom Layer: 85,65.96 85,63.08 84.58,62.66 82.55,62.66 81.91,62.02 81.91,58.96 81.45,58.5 77.6,58.5 76.96,59.13 76.96,65.84 77.47,66.35 84.61,66.35
RL_OUT2 on Bottom Layer: 85,49.8 84.56,49.36 77.94,49.36 76.84,50.47 76.84,57.2 77.6,57.96 81.53,57.96 81.91,57.58 81.91,53.65 82.68,52.88 84.6,52.88 85,52.48
RR_OUT1 on Top Layer: 0,52.07 0.64,52.71 2.92,52.71 3.71,53.5 3.71,57.85 4.08,58.22 8.41,58.22 9.14,57.49 9.14,54.94 8.67,54.47 7.43,54.47 5.21,52.25 5.21,49.84 4.32,48.95 0.8,48.95 0,49.75
RR_OUT2 on Top Layer: 0,65.88 0.64,66.51 8.98,66.51 9.27,66.22 9.27,59.14 8.38,58.25 3.8,58.25 3.27,58.78 3.27,61.8 2.54,62.54 0.62,62.54 0,63.15
$1N204 on Top Layer: 77.22,92.63 77.22,86.09 76.39,85.27 62.1,85.27 61.91,85.46 61.91,86.82 62.39,87.3 69.6,87.3 70.45,88.16 70.45,92.73 70.99,93.27 76.58,93.27
$1N206 on Top Layer: 69.98,92.66 70.23,92.41 70.23,90.86 69.98,90.6 68.2,90.6 67.18,89.59 67.18,87.55 67.06,87.43 65.66,87.43 65.15,87.94 65.15,95.68 65.52,96.05 66.81,96.05 67.18,95.68 67.18,93.65 68.17,92.66
$1N208 on Top Layer: 62.1,83.11 62.52,83.52 64.99,83.52 65.28,83.24 65.28,81.08 65.02,80.82 62.36,80.82 62.1,81.08
$1N208 on Top Layer: 63.25,95.94 64.52,95.94 64.73,95.72 64.73,87.77 64.39,87.43 63.25,87.43 62.99,87.68 62.99,95.68
$1N208 on Bottom Layer: 62.1,82.73 62.1,83.49 62.1,83.49 62.1,91.75 62.61,92.25 64.9,92.25 65.28,91.87 65.28,82.73 65.02,82.47 62.36,82.47
$1N209 on Top Layer: 59.31,94.06 59.31,94.92 60.32,95.93 62.49,95.93 62.87,95.56 62.87,88.32 62.23,87.68 58.93,87.68 57.66,88.95 57.66,92.41

Small or netless copper shapes (teardrops, artwork), in the pictures only: 105 on Top Layer, 70 on Bottom Layer

## Text on the board
Top Silkscreen Layer: PB7 | SDA | PB6 | GND | SCL | 5V | A8 | D0 | D4 | D6 | B5 | E1 | E2 | E3 | E5 | C13 | C12 | C9 | A15 | D1 | D5 | D7 | B4 | E0 | C3 | C2 | C8 | E4 | D2 | D3 | E6 | PC11 | RX | TX | PC10 | PB9 | PC0 | PC1 | PD10 | PD11 | PD13 | PB8 | PB0 | PB1 | PD14 | PD15 | PD12 | D8 | D9 | B14 | B15 | B13 | B12 | E15 | E14 | E13 | E12 | E10 | E8 | E7 | C5 | C4 | A5 | A4 | PB11 | PB10 | PA2 | PA3 | PE9 | PE11 | PA0 | PA1 | 3V3 | PC6 | PC7 | PA7 | PA6 | VOUT | VIN | ON | OFF | IIC1 | UART4 | UART2 | IIC2 | VIN指示灯 | 3V3指示灯 | 5V指示灯 | 郑一航 | 吴浩扬 | 李楷 | 力征 / 无界
